# EasyEDA Pro project 无线充电发射端.epro, schematic Schematic1
Board Name: Board1; Create Date: 2025-03-21; Page Name: P1; Project Name: 无线充电发射端（开发中）; Schematic Name: Schematic1; Update Date: 2025-07-09; Company: 嘉立创EDA; Page Size: A4; Version: V1.0
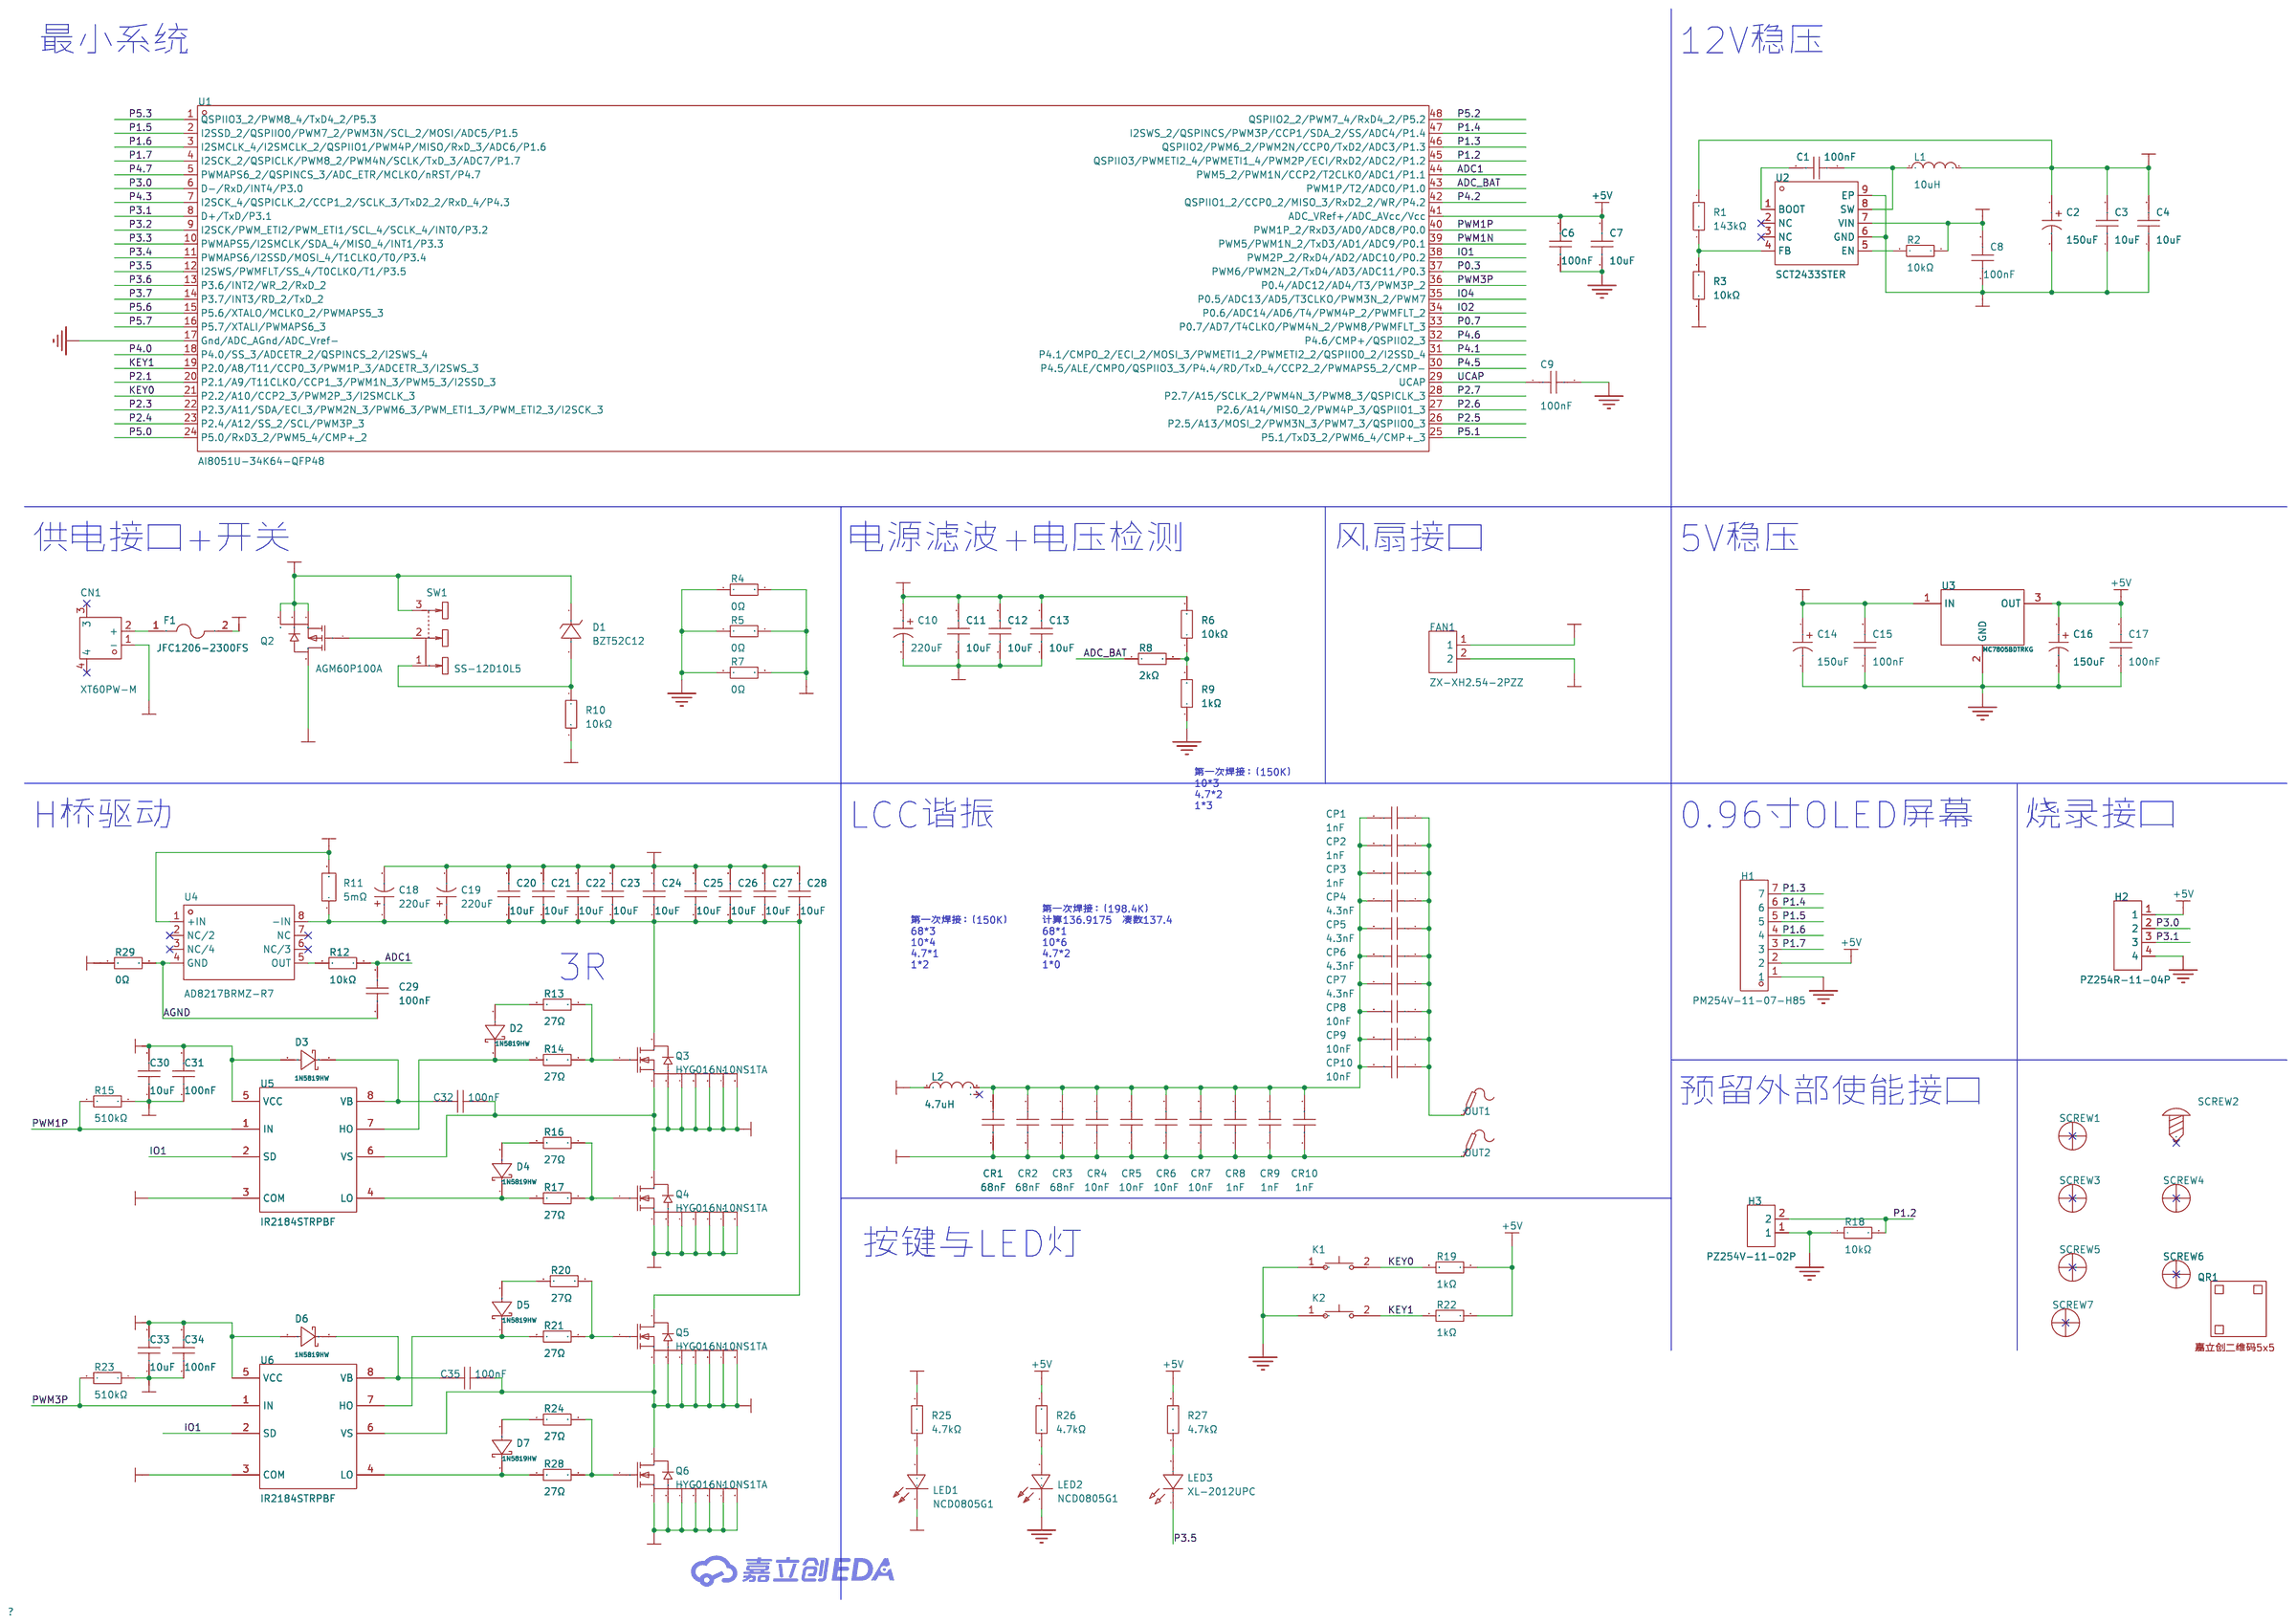
[diagram p0: schematic sheet]

## Parts
C1  100nF  [C0603]
C2  150uF  [CAP-TH_BD6.3-P2.50-D0.5-FD]
C3  10uF  [C1206]
C4  10uF  [C1206]
C6  100nF  [C0603]
C7  10uF  [C1206]
C8  100nF  [C0603]
C9  100nF  [C0603]
C10  220uF  [CAP-TH_BD8.0-P3.50-D0.6-FD]
C11  10uF  [C1206]
C12  10uF  [C1206]
C13  10uF  [C1206]
C14  150uF  [CAP-TH_BD6.3-P2.50-D0.5-FD]
C15  100nF  [C0603]
C16  150uF  [CAP-TH_BD6.3-P2.50-D0.5-FD]
C17  100nF  [C0603]
C18  220uF  [CAP-TH_BD8.0-P3.50-D0.6-FD]
C19  220uF  [CAP-TH_BD8.0-P3.50-D0.6-FD]
C20  10uF  [C1206]
C21  10uF  [C1206]
C22  10uF  [C1206]
C23  10uF  [C1206]
C24  10uF  [C1206]
C25  10uF  [C1206]
C26  10uF  [C1206]
C27  10uF  [C1206]
C28  10uF  [C1206]
C29  100nF  [C0603]
C30  10uF  [C1206]
C31  100nF  [C0603]
C32  100nF  [C0603]
C33  10uF  [C1206]
C34  100nF  [C0603]
C35  100nF  [C0603]
CN1  XT60PW-M  [CONN-TH_XT60PW-M]
CP1  1nF  [C1206]
CP2  1nF  [C1206]
CP3  1nF  [C1206]
CP4  4.3nF  [C1206]
CP5  4.3nF  [C1206]
CP6  4.3nF  [C1206]
CP7  4.3nF  [C1206]
CP8  10nF  [C1206]
CP9  10nF  [C1206]
CP10  10nF  [C1206]
CR1  68nF  [C1206]
CR2  68nF  [C1206]
CR3  68nF  [C1206]
CR4  10nF  [C1206]
CR5  10nF  [C1206]
CR6  10nF  [C1206]
CR7  10nF  [C1206]
CR8  1nF  [C1206]
CR9  1nF  [C1206]
CR10  1nF  [C1206]
D1  BZT52C12  [SOD-123_L2.7-W1.6-LS3.7-RD]
D2  1N5819HW  [SOD-123_L2.7-W1.6-LS3.8-RD]
D3  1N5819HW  [SOD-123_L2.7-W1.6-LS3.8-RD]
D4  1N5819HW  [SOD-123_L2.7-W1.6-LS3.8-RD]
D5  1N5819HW  [SOD-123_L2.7-W1.6-LS3.8-RD]
D6  1N5819HW  [SOD-123_L2.7-W1.6-LS3.8-RD]
D7  1N5819HW  [SOD-123_L2.7-W1.6-LS3.8-RD]
F1  JFC1206-2300FS  [F1206]
FAN1  ZX-XH2.54-2PZZ  [CONN-TH_2P-P2.50_HX25003-2A]
H1  PM254V-11-07-H85  [HDR-TH_7P-P2.54-V-F]
H2  PZ254R-11-04P  [HDR-TH_4P-P2.54-H-M-W10.4]
H3  PZ254V-11-02P  [HDR-TH_2P-P2.54-V-M]
K1  TS3625A  [KEY-SMD_L6.0-W3.5-LS8.4]
K2  TS3625A  [KEY-SMD_L6.0-W3.5-LS8.4]
L1  10uH  [IND-SMD_L4.1-W4.1_FTC404020S]
L2  4.7uH  [IND-SMD_3P-L28.0-W19.0-LS27.0]
LED1  NCD0805G1  [LED0805-R-RD]
LED2  NCD0805G1  [LED0805-R-RD]
LED3  XL-2012UPC  [LED0805-RD_PINK]
OUT1  -  [Test-Point-0.5mm]
OUT2  -  [Test-Point-0.5mm]
Q2  AGM60P100A  [TDSON-8_L5.9-W5.2-P1.27-BL]
Q3  HYG016N10NS1TA  [TOLL-8_L10.4-W9.9-P1.20-LS11.7-BL]
Q4  HYG016N10NS1TA  [TOLL-8_L10.4-W9.9-P1.20-LS11.7-BL]
Q5  HYG016N10NS1TA  [TOLL-8_L10.4-W9.9-P1.20-LS11.7-BL]
Q6  HYG016N10NS1TA  [TOLL-8_L10.4-W9.9-P1.20-LS11.7-BL]
QR1  -  [JLC-QRCODE-5x5]
R1  143kΩ  [R0603]
R2  10kΩ  [R0603]
R3  10kΩ  [R0603]
R4  0Ω  [R0603]
R5  0Ω  [R0603]
R6  10kΩ  [R0603]
R7  0Ω  [R0603]
R8  2kΩ  [R0603]
R9  1kΩ  [R0603]
R10  10kΩ  [R0603]
R11  5mΩ  [RES-SMD_L10.0-W5.2]
R12  10kΩ  [R0603]
R13  27Ω  [R0805]
R14  27Ω  [R0805]
R15  510kΩ  [R0603]
R16  27Ω  [R0805]
R17  27Ω  [R0805]
R18  10kΩ  [R0603]
R19  1kΩ  [R0603]
R20  27Ω  [R0805]
R21  27Ω  [R0805]
R22  1kΩ  [R0603]
R23  510kΩ  [R0603]
R24  27Ω  [R0805]
R25  4.7kΩ  [R0603]
R26  4.7kΩ  [R0603]
R27  4.7kΩ  [R0603]
R28  27Ω  [R0805]
R29  0Ω  [R0603]
SCREW1  -  [M3螺丝]
SCREW2  -  [M3螺丝]
SCREW3  -  [M3螺丝]
SCREW4  -  [M3螺丝]
SCREW5  -  [M3螺丝]
SCREW6  -  [M3螺丝]
SCREW7  -  [M3螺丝]
SW1  SS-12D10L5  [SW-TH_SS-12D10L5]
U1  AI8051U-34K64-QFP48  [LQFP-48_L7.0-W7.0-P0.50-LS9.0-BL_1]
U2  SCT2433STER  [ESOP-8_L4.9-W3.9-P1.27-LS6.0-BL-EP]
U3  MC7805BDTRKG  [TO-252-2_L6.6-W6.1-P4.57-LS9.9-TL-CW]
U4  AD8217BRMZ-R7  [MSOP-8_L3.0-W3.0-P0.65-LS5.0-BL]
U5  IR2184STRPBF  [SOIC-8_L5.0-W4.0-P1.27-LS6.0-BL]
U6  IR2184STRPBF  [SOIC-8_L5.0-W4.0-P1.27-LS6.0-BL]

## Library data of the parts
C1 C6 C8 C9 C15 C17 C29 C31 C32 C34 C35 = CC0603KRX7R9BB104: 容值:100nF;精度:±10%;额定电压:50V;材质(温度系数):X7R;; LCSC Part Name: 100nF ±10% 50V; Supplier Part: C14663; Manufacturer: YAGEO(国巨); Supplier Footprint: 0603; JLCPCB Part Class: 基础库; Datasheet: https://atta.szlcsc.com/upload/public/pdf/source/20180910/C282072_33301C7F631E79921B82A8DAC6BCC5B3.pdf; Supplier: LCSC; Tolerance: ±10%; Voltage Rated: 50V; Temperature Coefficient: X7R
C2 C14 C16 = HG1V157M0609PC: 容值:150uF;精度:±20%;额定电压:35V;纹波电流:2.55A;等效串联电阻:38mΩ;; LCSC Part Name: 150uF ±20% 35V; Supplier Part: C5438852; Manufacturer: HONOR(荣誉); Supplier Footprint: 插件,D6.3xL9mm; JLCPCB Part Class: 扩展库; Datasheet: https://atta.szlcsc.com/upload/public/pdf/source/20230323/E6B46A248FBB182638B68380B3289E6D.pdf; Supplier: LCSC; Tolerance: ±20%; Rated Voltage: 35V; Ripple Current: 2.55A; Equivalent Series Resistance(ESR): 38mΩ; Lead Spacing: 2.5mm; φD: 6.3mm; L: 9mm; Lifetime @ Temp: 2000hrs@105℃; Operating Temperature: -55℃~+105℃
C3 C4 C7 C11-C13 C20-C28 C30 C33 = GRM31CR61H106KA12L: 容值:10uF;精度:±10%;额定电压:50V;材质(温度系数):X5R;; LCSC Part Name: 10uF ±10% 50V; Supplier Part: C77092; Manufacturer: muRata(村田); Supplier Footprint: 1206; JLCPCB Part Class: 扩展库; Datasheet: https://atta.szlcsc.com/upload/public/pdf/source/20200305/C490387_23319AE8C154DEB24C505E6C82A8106A.pdf; Supplier: LCSC; Tolerance: ±10%; Voltage Rated: 50V; Temperature Coefficient: X5R
C10 C18 C19 = PA35V220M8x8: 容值:220uF;精度:±20%;额定电压:35V;纹波电流:2.9A@100Hz;等效串联电阻(ESR):28mΩ@100kHz;类型:-;; LCSC Part Name: 220uF ±20% 35V; Supplier Part: C46550431; Manufacturer: 捷而瑞; Supplier Footprint: 插件,D8xL8mm; JLCPCB Part Class: 扩展库; Datasheet: https://atta.szlcsc.com/upload/public/pdf/source/20250307/831193F737CAF6D75AC25F14E955F0EC.pdf; Supplier: LCSC; Tolerance: ±20%; Voltage Rating: 35V; Ripple Current: 2.9A@100Hz; Equivalent Series Resistance(ESR): 28mΩ@100kHz; Diameter: 8mm; Height - Seated (Max): 8mm; Lifetime: 2000hrs@105℃; Operating Temperature: -55℃~+105℃
CN1 = XT60PW-M: 类别:-;类型1:-;; LCSC Part Name: AMASS(艾迈斯)航模插头xt60连接器150公母对接pw锂电池公头 板插卧式XT60PW-M; Supplier Part: C98732; Manufacturer: AMASS(艾迈斯); JLCPCB Part Class: 扩展库; Datasheet: https://atta.szlcsc.com/upload/public/pdf/source/20240118/44A3DCFF53BE25DC65378AFFB21277A4.pdf; Supplier: LCSC; Type: 卧式插头; Colour: 黄色; InterfaceType: 公头
CP1-CP3 CR8-CR10 = CC1206JKNPOCBN102: 容值:1nF;精度:±5%;额定电压:1kV;材质(温度系数):NP0;; LCSC Part Name: 1nF ±5% 1kV; Supplier Part: C113872; Manufacturer: YAGEO(国巨); Supplier Footprint: 1206; Datasheet: https://atta.szlcsc.com/upload/public/pdf/source/20170914/C128857_1505359892143968080.pdf; Supplier: LCSC; Tolerance: ±5%; Voltage Rated: 1kV; Temperature Coefficient: NP0
CP4-CP7 = GRM3195C2A432JA01D: 容值:4.3nF;精度:±5%;额定电压:100V;材质(温度系数):C0G;; LCSC Part Name: 4.3nF ±5% 100V; Supplier Part: C2178478; Manufacturer: muRata(村田); Supplier Footprint: 1206; Datasheet: https://atta.szlcsc.com/upload/public/pdf/source/20230811/FF87FF72FFBF946A2511FFE3CC64A1B1.pdf; Supplier: LCSC; Tolerance: ±5%; Voltage Rated: 100V; Temperature Coefficient: C0G
CP8-CP10 CR4-CR7 = GCM3195C2A103JA16D: 容值:10nF;精度:±5%;额定电压:100V;材质(温度系数):C0G;; LCSC Part Name: 10nF ±5% 100V; Supplier Part: C184799; Manufacturer: muRata(村田); Supplier Footprint: 1206; Datasheet: https://atta.szlcsc.com/upload/public/pdf/source/20191226/C475964_3FAF76C90CD8FFB09F50C7480ADA926F.pdf; Supplier: LCSC; Tolerance: ±5%; Voltage Rated: 100V; Temperature Coefficient: C0G
CR1-CR3 = C3216C0G2A683JT000E: 容值:68nF;精度:±5%;额定电压:100V;温度系数:C0G;; LCSC Part Name: 68nF ±5% 100V; Supplier Part: C2991821; Manufacturer: TDK; Supplier Footprint: 1206; Datasheet: https://atta.szlcsc.com/upload/public/pdf/source/20220415/21C3EB6AB80DD056499B4D8EFDFCCE0A.pdf; Supplier: LCSC; Tolerance: ±5%; Voltage Rating: 100V; Temperature Coefficient: C0G
D1 = BZT52C12_C19077410: 二极管配置:独立式;稳压值(标称值):12V;稳压值(范围):11.4V~12.6V;功率(Pd):500mW;; Supplier Part: C19077410; Manufacturer: 宏迦橙; Supplier Footprint: SOD-123; JLCPCB Part Class: 扩展库; Datasheet: https://atta.szlcsc.com/upload/public/pdf/source/20241104/A31DF82E6D0CBEC29199D0B62829516E.pdf; Supplier: LCSC; Diode Configuration: 独立式; Zener Voltage (Nom): 12V; Reverse Leakage Current (Ir): 100nA@8V; Zener Voltage (Range): 11.4V~12.6V; Power Dissipation: 500mW; Zener Impedance (Zzt): 25Ω
D2-D7 = 1N5819HW_C41431974: 正向压降(Vf):580mV@1.0A;直流反向耐压(Vr):40V;整流电流:1A;; Supplier Part: C41431974; Manufacturer: GOODWORK(固得沃克); Supplier Footprint: SOD-123; Datasheet: https://atta.szlcsc.com/upload/public/pdf/source/20241016/F9575ED4EB339D9C6D56946D8A9F6336.pdf; Supplier: LCSC; Voltage - Forward(Vf@If): 580mV@1.0A; Voltage - DC Reverse(Vr): 40V; Current - Rectified: 1A; Reverse Leakage Current (Ir): 50uA@40V
F1 = JFC1206-2300FS: 类型:贴片式保险丝;额定电流:30A;额定电压 (AC):32V;额定电压:32V;分断能力:150A;; LCSC Part Name: 30A 32V 贴片式保险丝 快断; Supplier Part: C136359; Manufacturer: JDTfuse(集电通); Supplier Footprint: 1206; JLCPCB Part Class: 扩展库; Datasheet: https://atta.szlcsc.com/upload/public/pdf/source/20230515/8A56624F973AA51D74CDD59D07A1FF42.pdf; Supplier: LCSC; Type: 贴片式保险丝; Current Rating: 30A; Voltage Rating (AC): 32V; Voltage Rating (DC): 32V; Operating Temperature: -55℃~+125℃; Interrupt Rating: 150A
FAN1 = ZX-XH2.54-2PZZ: 插针结构:1x2P;间距:2.5mm;安装方式:直插;参考系列:XH;总PIN数:2P;排数:1;每排PIN数:2;行距:-;额定电流:3A;触头材质:黄铜;触头镀层:锡;工作温度范围:-25℃~+85℃;; LCSC Part Name: 1x2P 间距:2.5mm 直插 系列:XH; Supplier Part: C7429632; Manufacturer: Megastar(兆星); Supplier Footprint: 插件,P=2.5mm; JLCPCB Part Class: 扩展库; Datasheet: https://atta.szlcsc.com/upload/public/pdf/source/20230619/19BA6947230AA44A04D3EDD65E618FD0.pdf; Supplier: LCSC; Pins Structure: 1x2P; Pitch: 2.5mm; Mounting Type: 直插; Reference Series: XH; Number of Pins: 2P; Number of Rows: 1; Number of PINs Per Row: 2; Rated Current: 3A; Contact Material: 黄铜; Contact Plating: 锡; Operating Temperature: -25℃~+85℃; Rated Voltage (Max): 250V; Plastic Material: PA66; Flame Retardant Rating: UL94V-0; Color: 白色; Z-Height of the Board: 7mm; X-Length of Bottom Edge on Board (Spacing Line): 7.5mm; Y-Width of Bottom Edge on Board: 5.9mm
H1 = PM254V-11-07-H85: 插孔结构:1x7P;间距:2.54mm;行距:-;圆孔/方孔:方孔;安装类型:直插;排数:单排;总孔位数:7P;额定电流:3A;额定电压:250V;插孔方向:顶部;塑高:-;工作温度范围:-40℃~+105℃;; LCSC Part Name: 间距:2.54mm 1x7P 直插; Supplier Part: C2832270; Manufacturer: XFCN(兴飞); Supplier Footprint: 插件,P=2.54mm; JLCPCB Part Class: 扩展库; Datasheet: https://atta.szlcsc.com/upload/public/pdf/source/20210514/C2832270_F424CC0071A81298BFB56B53406F9842.pdf; Supplier: LCSC; Holes Structure: 1x7P; Pitch: 2.54mm; Circular Hole / Square Hole: 方孔; Mounting Type: 直插; Number of Rows: 单排; Number of Holes: 7P; Current Rating (Max): 3A; Voltage Rating (Max): 250V; Holes Direction: 顶部; Operating Temperature Range: -40℃~+105℃
H2 = PZ254R-11-04P: 插针结构:1x4P;间距:2.54mm;行距:-;圆针/方针:方针;安装方式:弯插;排数:单排;总PIN位数:4P;额定电流:-;额定电压:-;配合针长度:6mm;塑高:2.5mm;触头材质:黄铜;触头镀层:-;工作温度:-40℃~+105℃;颜色:黑色;; LCSC Part Name: 1x4P 间距:2.54mm 方针 弯插; Supplier Part: C492412; Manufacturer: XFCN(兴飞); Supplier Footprint: 弯插,P=2.54mm; JLCPCB Part Class: 扩展库; Datasheet: https://atta.szlcsc.com/upload/public/pdf/source/20200309/C492412_B0EFFC1946AB079B8871416C4A09EF6C.pdf; Supplier: LCSC; Pin Structure: 1x4P; Pitch: 2.54mm; Circluar Pins/Square Pins: 方针; Mounting Type: 弯插; Number of Rows: 单排; Number of Pins: 4P; Length of Mating Pin: 6mm; Insulation Height: 2.5mm; Contact Material: 黄铜; Operating Temperature: -40℃~+105℃; Color: 黑色
H3 = PZ254V-11-02P: 插针结构:1x2P;间距:2.54mm;行距:-;圆针/方针:方针;安装方式:直插;排数:单排;总PIN位数:2P;额定电流:-;额定电压:-;配合针长度:6mm;塑高:2.5mm;端接针长度:3mm;触头材质:黄铜;触头镀层:-;工作温度:-40℃~+105℃;颜色:黑色;; LCSC Part Name: 1x2P 间距:2.54mm 方针 直插; Supplier Part: C492401; Manufacturer: XFCN(兴飞); Supplier Footprint: 插件,P=2.54mm; JLCPCB Part Class: Extended Part; Datasheet: https://atta.szlcsc.com/upload/public/pdf/source/20200309/C492401_A812433581A9B211A7FFA413ADDFF0E5.pdf; Supplier: LCSC; Pin Structure: 1x2P; Pitch: 2.54mm; Circluar Pins/Square Pins: 方针; Mounting Type: 直插; Number of Rows: 单排; Number of Pins: 2P; Length of Mating Pin: 6mm; Insulation Height: 2.5mm; Length of End Connection Pin: 3mm; Contact Material: 黄铜; Operating Temperature: -40℃~+105℃; Color: 黑色
K1 K2 = TS3625A: 电路结构:单刀单掷;按钮形状:矩形按钮;作用力:250gf;安装方式:立贴;开关长度:6.1mm;开关宽度:3.65mm;开关高度:2.5mm;触点电流:50mA;额定电压(DC):12V;带灯:-;机械寿命:-;; LCSC Part Name: 6.1*3.65*2.5mm 立贴 轻触开关; Supplier Part: C398053; Manufacturer: SHOU HAN(首韩); Supplier Footprint: SMD; JLCPCB Part Class: Extended Part; Datasheet: https://atta.szlcsc.com/upload/public/pdf/source/20190620/C398053_EFFFB524A3F966B1F45EE8333D1EDECC.pdf; Supplier: LCSC; Circuit: 单刀单掷; Actuator Style: 矩形按钮; Operating Force: 250gf; Mounting Style: 立贴; Switch Length: 6.1mm; Switch Width: 3.65mm; Switch Height: 2.5mm; Contact Current: 50mA; Voltage Rating (DC): 12V
L1 = FTC404020S100MGCA: 电感值:10uH;精度:±20%;额定电流:3.4A;饱和电流(Isat):4.9A;类型:一体成型电感;; LCSC Part Name: 10uH ±20% 3.4A; Supplier Part: C39676074; Manufacturer: cjiang(长江微电); Supplier Footprint: SMD,4.1x4.1mm; JLCPCB Part Class: Extended Part; Datasheet: https://atta.szlcsc.com/upload/public/pdf/source/20240918/5AD8A1A0D9C2859F32750FF2CC514AFA.pdf; Supplier: LCSC; Tolerance: ±20%; Rated Current: 3.4A; Saturation Current (Isat): 4.9A; DC Resistance (DCR): 135mΩ; Type: 一体成型电感
L2 = RSBPQ2918-4R7M: 电感值:4.7uH;精度:±20%;额定电流:47.5A;饱和电流(Isat):49.5A;类型:扁平线大电流电感;; LCSC Part Name: 扁线大电流电感; Supplier Part: C32712987; Manufacturer: Ruishen(瑞申电子); Supplier Footprint: SMD-3P,28x20.3mm; Datasheet: https://atta.szlcsc.com/upload/public/pdf/source/20240725/68006C9F1CA03DEDE5951C9F792F9D9D.pdf; Supplier: LCSC; Tolerance: ±20%; Rated Current: 47.5A; Current - Saturation (Isat): 49.5A; DC Resistance (DCR): 0.97mΩ; Type: 扁平线大电流电感
LED1 LED2 = NCD0805G1: 发光颜色:翠绿色;正向电压(VF):2.5V~3.6V;功率:72mW;正向电流:5mA;主波长:525nm~537.5nm;透镜颜色:无色透明透镜;发光强度:180mcd~400mcd;发光角度:130°;工作温度:-30℃~+85℃;; Supplier Part: C84260; Manufacturer: 国星光电; Supplier Footprint: 0805; JLCPCB Part Class: 扩展库; Datasheet: https://atta.szlcsc.com/upload/public/pdf/source/20200820/C84260_AFC7BF57C6FBA034D182BB8D10A67EFE.pdf; Supplier: LCSC; Emitted Color: 翠绿色; Forward Voltage (VF): 2.5V~3.6V; Power Dissipation: 72mW; Forward Current: 5mA; Dominant Wavelength: 525nm~537.5nm; Lens Color: 无色透明透镜; Luminous Intensity: 180mcd~400mcd; Viewing Angle: 130°; Operating Temperature: -30℃~+85℃
LED3 = XL-2012UPC: 灯头类型:-;发光颜色:粉色;正向电压(VF):3.3V;功率:70mW;正向电流:20mA;主波长:-;二极管配置:-;透镜颜色:-;色温:-;发光强度:303mcd;发光角度:120°;载带方式:正贴;工作温度:-20℃~+85℃;; Supplier Part: C965821; Manufacturer: XINGLIGHT(成兴光); Supplier Footprint: 0805; JLCPCB Part Class: 扩展库; Datasheet: https://atta.szlcsc.com/upload/public/pdf/source/20240218/A96AF37DA93958101EC7A9E354C28E93.pdf; Supplier: LCSC; Emitted Color: 粉色; Forward Voltage (VF): 3.3V; Power Dissipation: 70mW; Forward Current: 20mA; Luminous Intensity: 303mcd; Viewing Angle: 120°; Mounting Sytle: 正贴; Operating Temperature: -20℃~+85℃
OUT1 OUT2 = Test-Point: Test Point 测试点; Check: false
Q2 = AGM60P100A: 类型:1个P沟道;漏源电压(Vdss):60V;连续漏极电流(Id):140A;导通电阻(RDS(on)@Vgs,Id):6.5mΩ@4.5V,10A;功率(Pd):150W;阈值电压(Vgs(th)@Id):1.3V@250uA;; LCSC Part Name: 1个P沟道 耐压:60V 电流:100A; Supplier Part: C5373096; Manufacturer: AGM-Semi(芯控源); Supplier Footprint: PDFN-8(5x6); JLCPCB Part Class: 扩展库; Datasheet: https://atta.szlcsc.com/upload/public/pdf/source/20241108/A068B77F4A82E836D758702AA2819D88.pdf; Supplier: LCSC; Type: 1个P沟道; Drain Source Voltage (Vdss): 60V; Continuous Drain Current (Id): 140A; Drain Source On Resistance (RDS(on)@Vgs,Id): 6.5mΩ@4.5V,10A; Power Dissipation (Pd): 150W; Gate Threshold Voltage (Vgs(th)@Id): 1.3V@250uA; Total Gate Charge (Qg@Vgs): 56nC@10V; Input Capacitance (Ciss@Vds): 3.06nF@30V; Reverse Transfer Capacitance (Crss@Vds): 20pF; Operating Temperature: -55℃~+150℃
Q3-Q6 = HYG016N10NS1TA: 类型:1个N沟道;漏源电压(Vdss):100V;连续漏极电流(Id):370A;导通电阻(RDS(on)@Vgs,Id):1.35mΩ@10V,100A;功率(Pd):428.5W;阈值电压(Vgs(th)@Id):2V@250uA;; Supplier Part: C6851451; Manufacturer: HUAYI(华羿微); Supplier Footprint: TOLL; JLCPCB Part Class: 扩展库; Datasheet: https://atta.szlcsc.com/upload/public/pdf/source/20230526/4FE6780917F1971150D0DFE89A875E57.pdf; Supplier: LCSC; Type: 1个N沟道; Drain Source Voltage (Vdss): 100V; Continuous Drain Current (Id): 370A; Drain Source On Resistance (RDS(on)@Vgs,Id): 1.35mΩ@10V,100A; Power Dissipation (Pd): 428.5W; Gate Threshold Voltage (Vgs(th)@Id): 2V@250uA; Reverse Transfer Capacitance (Crss@Vds): 275pF; Operating Temperature: -55℃~+175℃
QR1 = 嘉立创二维码5x5: Check: false
R1 = 0603WAF1433T5E: 电阻类型:厚膜电阻;阻值:143kΩ;精度:±1%;功率:100mW;最大工作电压:75V;温度系数:±100ppm/℃;; LCSC Part Name: 143kΩ ±1% 100mW 厚膜电阻; Supplier Part: C22877; Manufacturer: UNI-ROYAL(厚声); Supplier Footprint: 0603; JLCPCB Part Class: 扩展库; Datasheet: https://atta.szlcsc.com/upload/public/pdf/source/20200306/C422600_1E6D84923E4A46A82E41ADD87F860B5C.pdf; Supplier: LCSC; Type: 厚膜电阻; Tolerance: ±1%; Power(Watts): 100mW; Overload Voltage (Max): 75V; Temperature Coefficient: ±100ppm/℃; Operating Temperature Range: -55℃~+155℃
R2 R3 R10 = 0603WAF1002T5E: 电阻类型:厚膜电阻;阻值:10kΩ;精度:±1%;功率:100mW;最大工作电压:75V;温度系数:±100ppm/℃;; LCSC Part Name: 厚膜电阻 10kΩ ±1% 100mW; Supplier Part: C25804; Manufacturer: UNI-ROYAL(厚声); Supplier Footprint: 0603; JLCPCB Part Class: Basic Part; Datasheet: https://atta.szlcsc.com/upload/public/pdf/source/20200306/C422600_1E6D84923E4A46A82E41ADD87F860B5C.pdf; Supplier: LCSC; Type: 厚膜电阻; Tolerance: ±1%; Power(Watts): 100mW; Overload Voltage (Max): 75V; Temperature Coefficient: ±100ppm/℃; Operating Temperature Range: -55℃~+155℃
R4 R5 R7 R29 = 0603WAF0000T5E: 电阻类型:厚膜电阻;阻值:0Ω;精度:±1%;功率:100mW;最大工作电压:75V;; LCSC Part Name: 0Ω ±1% 100mW 厚膜电阻; Supplier Part: C21189; Manufacturer: UNI-ROYAL(厚声); Supplier Footprint: 0603; JLCPCB Part Class: 基础库; Datasheet: https://atta.szlcsc.com/upload/public/pdf/source/20200306/C422600_1E6D84923E4A46A82E41ADD87F860B5C.pdf; Supplier: LCSC; Type: 厚膜电阻; Tolerance: ±1%; Power(Watts): 100mW; Overload Voltage (Max): 75V; Operating Temperature Range: -55℃~+155℃
R6 R12 R18 = 0603WAF1002T5E: 电阻类型:厚膜电阻;阻值:10kΩ;精度:±1%;功率:100mW;最大工作电压:75V;温度系数:±100ppm/℃;; LCSC Part Name: 厚膜电阻 10kΩ ±1% 100mW; Supplier Part: C25804; Manufacturer: UNI-ROYAL(厚声); Supplier Footprint: 0603; JLCPCB Part Class: 基础库; Datasheet: https://atta.szlcsc.com/upload/public/pdf/source/20200306/C422600_1E6D84923E4A46A82E41ADD87F860B5C.pdf; Supplier: LCSC; Type: 厚膜电阻; Tolerance: ±1%; Power(Watts): 100mW; Overload Voltage (Max): 75V; Temperature Coefficient: ±100ppm/℃; Operating Temperature Range: -55℃~+155℃
R8 = 0603WAF2001T5E: 电阻类型:厚膜电阻;阻值:2kΩ;精度:±1%;功率:100mW;最大工作电压:75V;温度系数:±100ppm/℃;; LCSC Part Name: 2kΩ ±1% 100mW 厚膜电阻; Supplier Part: C22975; Manufacturer: UNI-ROYAL(厚声); Supplier Footprint: 0603; JLCPCB Part Class: 基础库; Datasheet: https://atta.szlcsc.com/upload/public/pdf/source/20200306/C422600_1E6D84923E4A46A82E41ADD87F860B5C.pdf; Supplier: LCSC; Type: 厚膜电阻; Tolerance: ±1%; Power(Watts): 100mW; Overload Voltage (Max): 75V; Temperature Coefficient: ±100ppm/℃; Operating Temperature Range: -55℃~+155℃
R9 R19 R22 = 0603WAF1001T5E: 电阻类型:厚膜电阻;阻值:1kΩ;精度:±1%;功率:100mW;最大工作电压:75V;温度系数:±100ppm/℃;; LCSC Part Name: 1kΩ ±1% 100mW 厚膜电阻; Supplier Part: C21190; Manufacturer: UNI-ROYAL(厚声); Supplier Footprint: 0603; JLCPCB Part Class: 基础库; Datasheet: https://atta.szlcsc.com/upload/public/pdf/source/20200306/C422600_1E6D84923E4A46A82E41ADD87F860B5C.pdf; Supplier: LCSC; Type: 厚膜电阻; Tolerance: ±1%; Power(Watts): 100mW; Overload Voltage (Max): 75V; Temperature Coefficient: ±100ppm/℃; Operating Temperature Range: -55℃~+155℃
R11 = HolRS3921-5W-5mR-1%: 阻值:5mΩ;功率:5W;; LCSC Part Name: 5mΩ 5W; Supplier Part: C2927599; Manufacturer: Milliohm(毫欧); Supplier Footprint: 3921; JLCPCB Part Class: 扩展库; Datasheet: https://atta.szlcsc.com/upload/public/pdf/source/20211215/E1907577CFDCF4219C49C824D1629BD3.pdf; Supplier: LCSC; Power(Watts): 5W
R13 R14 R16 R17 R20 R21 R24 R28 = 0805W8F270JT5E: 电阻类型:厚膜电阻;阻值:27Ω;精度:±1%;功率:125mW;最大工作电压:150V;温度系数:±100ppm/℃;; LCSC Part Name: 27Ω ±1% 125mW 厚膜电阻; Supplier Part: C17594; Manufacturer: UNI-ROYAL(厚声); Supplier Footprint: 0805; JLCPCB Part Class: 扩展库; Datasheet: https://atta.szlcsc.com/upload/public/pdf/source/20200306/C422600_1E6D84923E4A46A82E41ADD87F860B5C.pdf; Supplier: LCSC; Type: 厚膜电阻; Tolerance: ±1%; Power(Watts): 125mW; Overload Voltage (Max): 150V; Temperature Coefficient: ±100ppm/℃; Operating Temperature Range: -55℃~+155℃
R15 R23 = 0603WAF5103T5E: 电阻类型:厚膜电阻;阻值:510kΩ;精度:±1%;功率:100mW;最大工作电压:75V;温度系数:±100ppm/℃;; LCSC Part Name: 510kΩ ±1% 100mW 厚膜电阻; Supplier Part: C23192; Manufacturer: UNI-ROYAL(厚声); Supplier Footprint: 0603; JLCPCB Part Class: 基础库; Datasheet: https://atta.szlcsc.com/upload/public/pdf/source/20200306/C422600_1E6D84923E4A46A82E41ADD87F860B5C.pdf; Supplier: LCSC; Type: 厚膜电阻; Tolerance: ±1%; Power(Watts): 100mW; Overload Voltage (Max): 75V; Temperature Coefficient: ±100ppm/℃; Operating Temperature Range: -55℃~+155℃
R25-R27 = RC0603FR-074K7L: 电阻类型:厚膜电阻;阻值:4.7kΩ;精度:±1%;功率:100mW;最大工作电压:75V;温度系数:±100ppm/℃;; LCSC Part Name: 厚膜电阻 4.7kΩ ±1% 100mW; Supplier Part: C99782; Manufacturer: YAGEO(国巨); Supplier Footprint: 0603; JLCPCB Part Class: 扩展库; Datasheet: https://atta.szlcsc.com/upload/public/pdf/source/20180224/C181757_15194369480721363983.pdf; Supplier: LCSC; Type: 厚膜电阻; Tolerance: ±1%; Power(Watts): 100mW; Overload Voltage (Max): 75V; Temperature Coefficient: ±100ppm/℃; Operating Temperature Range: -55℃~+155℃
SCREW1 SCREW3-SCREW7 = M3螺丝: Check: false
SCREW2 = M3螺丝: Supplier Footprint: 插件; Check: false
SW1 = SS-12D10L5: 电路结构:单刀双掷;安装方式:直插;开关颜色:黑色;额定电流(DC):3A;额定电压(DC):125V;额定电流(AC):3A;额定电压(AC):125V;机械寿命:1万次;; LCSC Part Name: 柄长5mm 直插双档 滑动开关; Supplier Part: C319012; Manufacturer: XKB Connectivity(中国星坤); Supplier Footprint: 插件; Datasheet: https://atta.szlcsc.com/upload/public/pdf/source/20211009/D6412F37AABE6F9459A6EE7FA4DAEADB.pdf; Supplier: LCSC; Circuit: 单刀双掷; Actuator Style: 矩形柱状; Pin Style: PC引脚; Switch Length: 13mm; Switch Width: 6.8mm; Switch Height: 6.4mm; Mounting Style: 直插; Actuator Color: 黑色; Current Rating (DC): 3A; Voltage Rating (DC): 125V; Current Rating (AC): 3A; Voltage Rating (AC): 125V; Mechanical Life: 1万次; Operating Temperature: -40℃~+85℃
U1 = AI8051U-34K64-QFP48: 硬件浮点/硬件三角函数 跑100MHz, 32位8051-CPU 跑 42MHz，PWM 有硬件移相功能，DMA支持外设到外设，DMA支持PWM; Supplier Part: C41427635; Manufacturer: STC; Supplier Footprint: QFP-48; JLCPCB Part Class: 扩展库; Datasheet: https://atta.szlcsc.com/upload/public/pdf/source/20250205/562F2E468F0EB942ABE66F38F3AE2970.pdf; Supplier: LCSC
U2 = SCT2433STER: 功能类型:降压型;输出类型:可调;工作电压:3.8V~40V;输出电压:800mV~40V;输出电流:3.5A;; LCSC Part Name: 3.5A 同步降压 DC-DC 转换器; Supplier Part: C509399; Manufacturer: SCT(芯洲科技); Supplier Footprint: ESOP-8; JLCPCB Part Class: 扩展库; Datasheet: https://atta.szlcsc.com/upload/public/pdf/source/20200407/C509399_F5B0FDCDE9064A78F82C6EEBD7D1874E.pdf; Supplier: LCSC; Function: 降压型; Output Type: 可调; Input Voltage: 3.8V~40V; Output Voltage: 800mV~40V; Output Current: 3.5A; Switching Frequency: 570kHz; Operating Temperature: -40℃~+125℃; Synchronous Rectification: 是; Number of Outputs: 1; Topology: 降压式; Quiescent Current (Iq): 25uA; Switch tube (built-in/external): 内置
U3 = MC7805BDTRKG: 输出类型:固定;最大输入电压:35V;输出电压:5V;最大输出电流:1A;电源纹波抑制比(PSRR):68dB@(120Hz);输出极性:正极;; Supplier Part: C110908; Manufacturer: onsemi(安森美); Supplier Footprint: TO-252-2(DPAK); JLCPCB Part Class: 扩展库; Datasheet: https://atta.szlcsc.com/upload/public/pdf/source/20181108/C327508_B78150FF97C8C38061229236786A5884.pdf; Supplier: LCSC; Output Type: 固定; Maximum Input Voltage: 35V; Output Voltage: 5V; MAX Output Current: 1A; Power Supply Rejection Ratio (PSRR): 68dB@(120Hz); Dropout Voltage: 2V@(1A); standby current: 8mA; Operating Temperature: -40℃~+125℃; Output Polarity: 正极; Number of Outputs: 1
U4 = AD8217BRMZ-R7: Supplier Part: C141937; Manufacturer: ADI(亚德诺); Supplier Footprint: MSOP-8; JLCPCB Part Class: 扩展库; Datasheet: https://atta.szlcsc.com/upload/public/pdf/source/20171123/C141937_15114109921631137666.pdf; Supplier: LCSC; Supply Voltage: 4.5V~80V; Operating Temperature: -40℃~+125℃
U5 U6 = IR2184STRPBF: 驱动配置:半桥;负载类型:MOSFET；IGBT;驱动通道数:2;峰值灌电流:2.3A;峰值拉电流:1.9A;电源电压:10V~20V;上升时间:40ns;下降时间:20ns;; Supplier Part: C2995; Manufacturer: Infineon(英飞凌); Supplier Footprint: SOIC-8; JLCPCB Part Class: 扩展库; Datasheet: https://atta.szlcsc.com/upload/public/pdf/source/20180428/C212202_166266BE420162375EE24979A7C0A97C.pdf; Supplier: LCSC; Driven Configuration: 半桥; Load Type: MOSFET；IGBT; Number of Drivers: 2; Peak Output Current(sink): 2.3A; Peak Output Current(source): 1.9A; Supply Voltage: 10V~20V; Rise Time: 40ns; Fall Time: 20ns; Operating Temperature: -40℃~+150℃@(Tj)

## Nets
+5V: C6.2 C7.2 C16.1 C17.2 H1.2 H2.1 R19.1 R22.1 R26.2 R27.2 U1.41(ADC_VRef+/ADC_AVcc/Vcc) U3.3(OUT)
+12V: C2.1 C3.2 C4.2 C14.1 C15.2 C30.2 C31.2 C33.2 C34.2 D3.2(A) D6.2(A) L1.2 R1.2 R25.2 U3.1(IN) U5.5(VCC) U6.5(VCC)
+24V: C8.2 C10.1 C11.2 C12.2 C13.2 FAN1.1 Q2.5(D) R2.1 R6.2 R11.2 U2.7(VIN) U4.1(+IN)
AGND: C29.1 R29.2 U4.4(GND)
GND: C6.1 C7.1 C9.2 C14.2 C15.1 C16.2 C17.1 H1.1 H2.4 H3.1 K1.1 K2.1 LED2.2(K) R4.1 R5.1 R7.1 R9.1 R18.1 U1.17(Gnd/ADC_AGnd/ADC_Vref-) U3.2(GND)
PGND: C2.2 C3.1 C4.1 C8.1 C10.2 C11.1 C12.1 C13.1 C18.2 C19.2 C20.2 C21.2 C22.2 C23.2 C24.2 C25.2 C26.2 C27.2 C28.2 C30.1 C31.1 C33.1 C34.1 CN1.1(-) FAN1.2 LED1.2(K) Q4.2(S) Q4.3(S) Q4.4(S) Q4.5(S) Q4.6(S) Q4.7(S) Q4.8(S) Q6.2(S) Q6.3(S) Q6.4(S) Q6.5(S) Q6.6(S) Q6.7(S) Q6.8(S) R3.1 R4.2 R5.2 R7.2 R10.2 R15.1 R23.1 R29.1 U2.6(GND) U2.9(EP) U5.3(COM) U6.3(COM)
VIN: D1.1(K) F1.2 Q2.1(S) Q2.2(S) Q2.3(S) SW1.3
ADC1: C29.2 R12.1 U1.44(PWM5_2/PWM1N/CCP2/T2CLKO/ADC1/P1.1)
ADC_BAT: R8.1 U1.43(PWM1P/T2/ADC0/P1.0)
IO1: U1.38(PWM2P_2/RxD4/AD2/ADC10/P0.2) U5.2(SD) U6.2(SD)
IO2: U1.34(P0.6/ADC14/AD6/T4/PWM4P_2/PWMFLT_2)
IO4: U1.35(P0.5/ADC13/AD5/T3CLKO/PWM3N_2/PWM7)
KEY0: K1.2 R19.2 U1.21(P2.2/A10/CCP2_3/PWM2P_3/I2SMCLK_3)
KEY1: K2.2 R22.2 U1.19(P2.0/A8/T11/CCP0_3/PWM1P_3/ADCETR_3/I2SWS_3)
OUT1: C35.2 L2.1 Q5.2(S) Q5.3(S) Q5.4(S) Q5.5(S) Q5.6(S) Q5.7(S) Q5.8(S) Q6.9(D) U6.6(VS)
OUT2: C32.2 CR1.2 CR2.2 CR3.2 CR4.1 CR5.1 CR6.1 CR7.1 CR8.1 CR9.1 CR10.1 OUT2.1 Q3.2(S) Q3.3(S) Q3.4(S) Q3.5(S) Q3.6(S) Q3.7(S) Q3.8(S) Q4.9(D) U5.6(VS)
P0.3: U1.37(PWM6/PWM2N_2/TxD4/AD3/ADC11/P0.3)
P0.7: U1.33(P0.7/AD7/T4CLKO/PWM4N_2/PWM8/PWMFLT_3)
P1.2: H3.2 R18.2 U1.45(QSPIIO3/PWMETI2_4/PWMETI1_4/PWM2P/ECI/RxD2/ADC2/P1.2)
P1.3: H1.7 U1.46(QSPIIO2/PWM6_2/PWM2N/CCP0/TxD2/ADC3/P1.3)
P1.4: H1.6 U1.47(I2SWS_2/QSPINCS/PWM3P/CCP1/SDA_2/SS/ADC4/P1.4)
P1.5: H1.5 U1.2(I2SSD_2/QSPIIO0/PWM7_2/PWM3N/SCL_2/MOSI/ADC5/P1.5)
P1.6: H1.4 U1.3(I2SMCLK_4/I2SMCLK_2/QSPIIO1/PWM4P/MISO/RxD_3/ADC6/P1.6)
P1.7: H1.3 U1.4(I2SCK_2/QSPICLK/PWM8_2/PWM4N/SCLK/TxD_3/ADC7/P1.7)
P2.1: U1.20(P2.1/A9/T11CLKO/CCP1_3/PWM1N_3/PWM5_3/I2SSD_3)
P2.3: U1.22(P2.3/A11/SDA/ECI_3/PWM2N_3/PWM6_3/PWM_ETI1_3/PWM_ETI2_3/I2SCK_3)
P2.4: U1.23(P2.4/A12/SS_2/SCL/PWM3P_3)
P2.5: U1.26(P2.5/A13/MOSI_2/PWM3N_3/PWM7_3/QSPIIO0_3)
P2.6: U1.27(P2.6/A14/MISO_2/PWM4P_3/QSPIIO1_3)
P2.7: U1.28(P2.7/A15/SCLK_2/PWM4N_3/PWM8_3/QSPICLK_3)
P3.0: H2.2 U1.6(D-/RxD/INT4/P3.0)
P3.1: H2.3 U1.8(D+/TxD/P3.1)
P3.2: U1.9(I2SCK/PWM_ETI2/PWM_ETI1/SCL_4/SCLK_4/INT0/P3.2)
P3.3: U1.10(PWMAPS5/I2SMCLK/SDA_4/MISO_4/INT1/P3.3)
P3.4: U1.11(PWMAPS6/I2SSD/MOSI_4/T1CLKO/T0/P3.4)
P3.5: LED3.1(K) U1.12(I2SWS/PWMFLT/SS_4/T0CLKO/T1/P3.5)
P3.6: U1.13(P3.6/INT2/WR_2/RxD_2)
P3.7: U1.14(P3.7/INT3/RD_2/TxD_2)
P4.0: U1.18(P4.0/SS_3/ADCETR_2/QSPINCS_2/I2SWS_4)
P4.1: U1.31(P4.1/CMPO_2/ECI_2/MOSI_3/PWMETI1_2/PWMETI2_2/QSPIIO0_2/I2SSD_4)
P4.2: U1.42(QSPIIO1_2/CCP0_2/MISO_3/RxD2_2/WR/P4.2)
P4.3: U1.7(I2SCK_4/QSPICLK_2/CCP1_2/SCLK_3/TxD2_2/RxD_4/P4.3)
P4.5: U1.30(P4.5/ALE/CMPO/QSPIIO3_3/P4.4/RD/TxD_4/CCP2_2/PWMAPS5_2/CMP-)
P4.6: U1.32(P4.6/CMP+/QSPIIO2_3)
P4.7: U1.5(PWMAPS6_2/QSPINCS_3/ADC_ETR/MCLKO/nRST/P4.7)
P5.0: U1.24(P5.0/RxD3_2/PWM5_4/CMP+_2)
P5.1: U1.25(P5.1/TxD3_2/PWM6_4/CMP+_3)
P5.2: U1.48(QSPIIO2_2/PWM7_4/RxD4_2/P5.2)
P5.3: U1.1(QSPIIO3_2/PWM8_4/TxD4_2/P5.3)
P5.6: U1.15(P5.6/XTALO/MCLKO_2/PWMAPS5_3)
P5.7: U1.16(P5.7/XTALI/PWMAPS6_3)
PWM1N: U1.39(PWM5/PWM1N_2/TxD3/AD1/ADC9/P0.1)
PWM1P: R15.2 U1.40(PWM1P_2/RxD3/AD0/ADC8/P0.0) U5.1(IN)
PWM3P: R23.2 U1.36(P0.4/ADC12/AD4/T3/PWM3P_2) U6.1(IN)
UCAP: C9.1 U1.29(UCAP)
$1N1691: R6.1 R8.2 R9.2
$1N5440: LED1.1(A) R25.1
$1N5444: LED2.1(A) R26.1
$1N5449: LED3.2(A) R27.1
$1N5962: R12.2 U4.5(OUT)
$1N17116: D1.2(A) R10.1 SW1.1
$1N17498: Q2.4(G) SW1.2
$1N21474: R2.2 U2.5(EN)
$1N21475: C1.1 L1.1 U2.8(SW)
$1N21476: C1.2 U2.1(BOOT)
$1N21478: R1.1 R3.2 U2.4(FB)
$1N25690: CP1.2 CP2.2 CP3.2 CP4.2 CP5.2 CP6.2 CP7.2 CP8.2 CP9.2 CP10.2 CR1.1 CR2.1 CR3.1 CR4.2 CR5.2 CR6.2 CR7.2 CR8.2 CR9.2 CR10.2 L2.2
$1N26279: CP1.1 CP2.1 CP3.1 CP4.1 CP5.1 CP6.1 CP7.1 CP8.1 CP9.1 CP10.1 OUT1.1
$1N26815: C18.1 C19.1 C20.1 C21.1 C22.1 C23.1 C24.1 C25.1 C26.1 C27.1 C28.1 Q3.9(D) Q5.9(D) R11.1 U4.8(-IN)
$1N28111: Q6.1(G) R24.2 R28.2
$1N28126: D7.2(A) R24.1
$1N28132: D7.1(C) R28.1 U6.4(LO)
$1N28147: Q5.1(G) R20.2 R21.2
$1N28152: D5.1(C) R21.1 U6.7(HO)
$1N28166: D5.2(A) R20.1
$1N28183: Q4.1(G) R16.2 R17.2
$1N28208: D4.1(C) R17.1 U5.4(LO)
$1N28222: D4.2(A) R16.1
$1N28228: Q3.1(G) R13.2 R14.2
$1N28245: D2.1(C) R14.1 U5.7(HO)
$1N28259: D2.2(A) R13.1
$1N28378: C35.1 D6.1(C) U6.8(VB)
$1N28442: C32.1 D3.1(C) U5.8(VB)
$1N33414: CN1.2(+) F1.1

Not connected (* = marked no-connect by the designer): CN1 3* 4*; L2 3*; SCREW1 1*; SCREW2 1*; SCREW3 1*; SCREW4 1*; SCREW5 1*; SCREW6 1*; SCREW7 1*; U2 2(NC)* 3(NC)*; U4 2(NC/2)* 3(NC/4)* 6(NC/3)* 7(NC)*

## Notes on the sheet
- 最小系统
- 12V稳压
- 供电接口+开关
- 电源滤波+电压检测
- 风扇接口
- 5V稳压
- 第一次焊接：（150K）
  10*3
  4.7*2
  1*3
- H桥驱动
- LCC谐振
- 0.96寸OLED屏幕
- 烧录接口
- 第一次焊接：（150K）
  68*3
  10*4
  4.7*1
  1*2
- 第一次焊接：（198.4K）
  计算136.9175  凑数137.4
  68*1
  10*6
  4.7*2
  1*0
- 3R
- 预留外部使能接口
- 按键与LED灯
